# Altium schematic sheet DAC.SchDoc
size A4; SheetNumber: 2; SheetTotal: 5
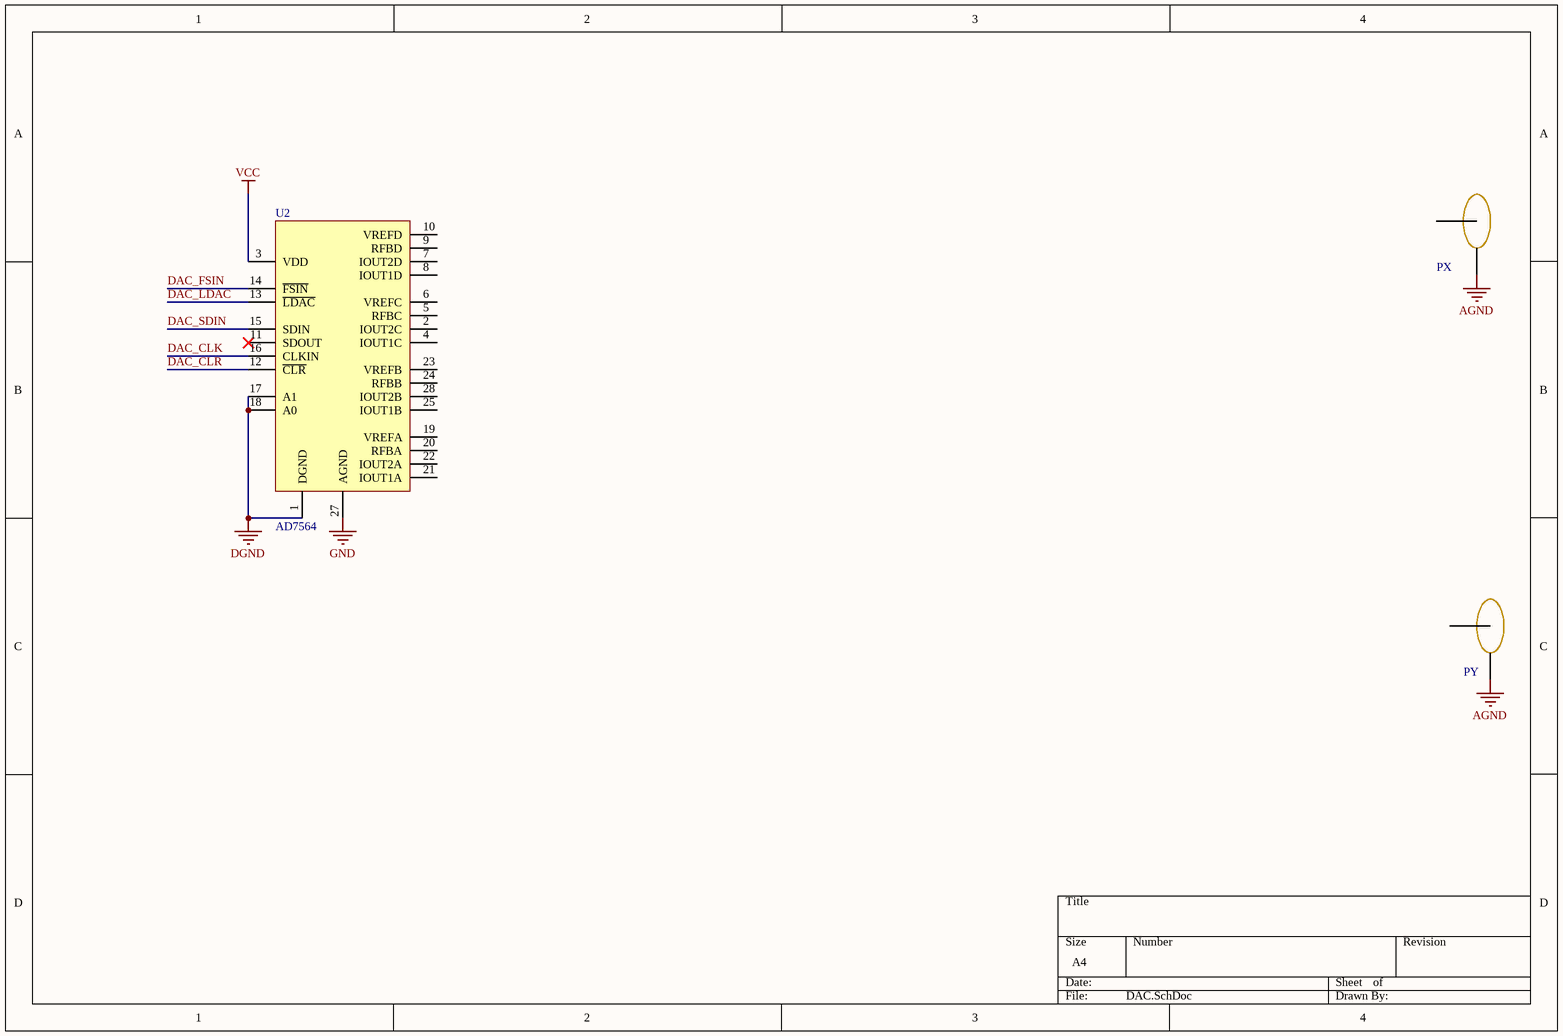
[diagram p0: DAC.SchDoc]

## Parts
PX  PCB.SMAFRA.HT  [PCB.SMAFRA.HT]  (value not drawn)
PY  PCB.SMAFRA.HT  [PCB.SMAFRA.HT]  (value not drawn)
U2  AD7564  [AD7564]

## Nets
AGND: PX.S PY.S
DGND: U2.1(DGND) U2.17(A1) U2.18(A0)
GND: U2.27(AGND)
VCC: U2.3(VDD)
DAC_CLK: U2.16(CLKIN)
DAC_CLR: U2.12(~{CLR})
DAC_FSIN: U2.14(~{FSIN})
DAC_LDAC: U2.13(~{LDAC})
DAC_SDIN: U2.15(SDIN)

Not connected (* = marked no-connect by the designer): PX 1; PY 1; U2 2(IOUT2C) 4(IOUT1C) 5(RFBC) 6(VREFC) 7(IOUT2D) 8(IOUT1D) 9(RFBD) 10(VREFD) 11(SDOUT)* 19(VREFA) 20(RFBA) 21(IOUT1A) 22(IOUT2A) 23(VREFB) 24(RFBB) 25(IOUT1B) 28(IOUT2B)

## Library data of the parts
U2 = AD7564: +3.3 V/+5 V, Low Power, Quad 12-Bit DAC
PX PY = PCB.SMAFRA.HT: Supplier 1: Digi-Key; Supplier 2: Mouser; Supplier Part Number 2: 960-PCB.SMAFRA.HT; Supplier Part Number 1: 931-1361-ND